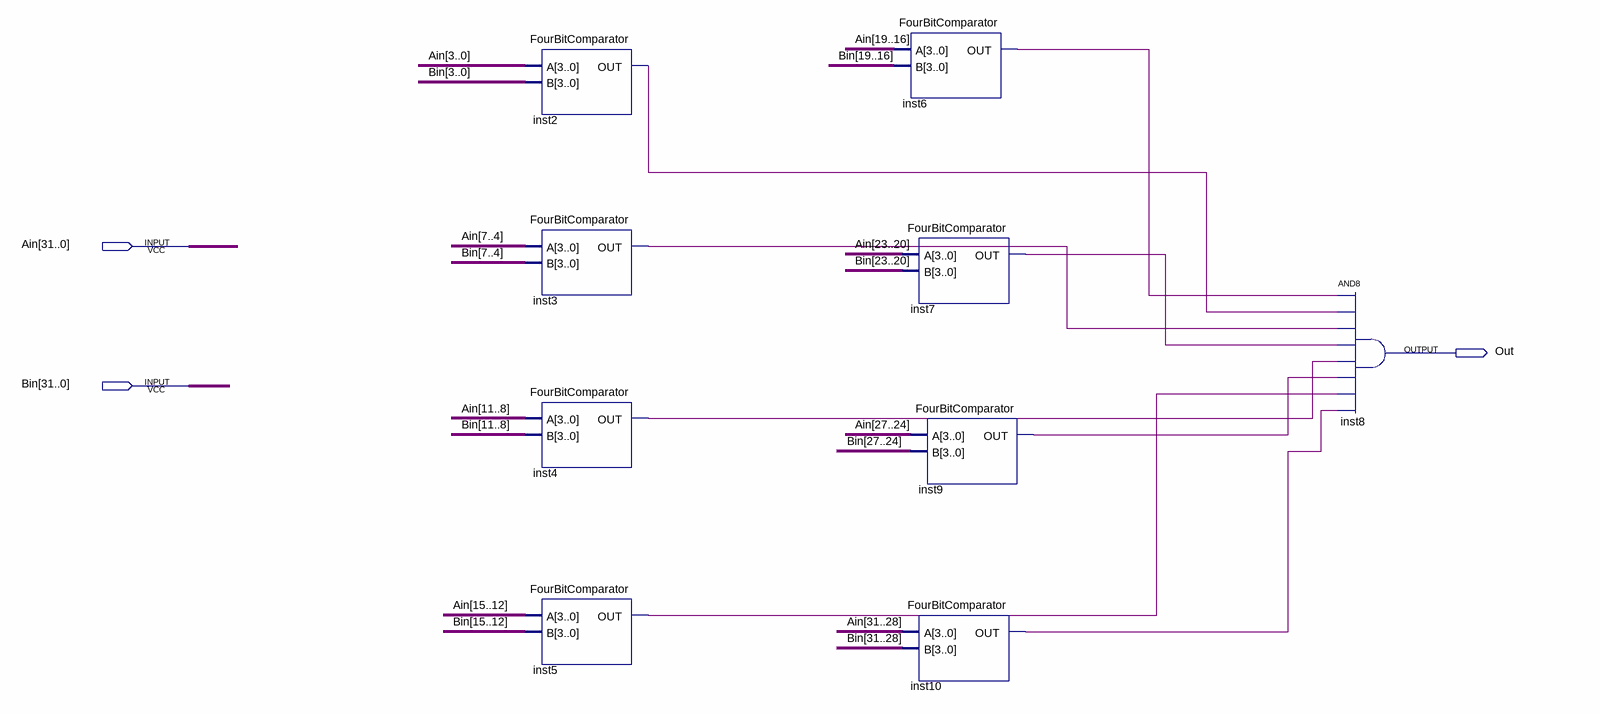
[diagram p0: schematic sheet]
// Quartus schematic ThirtyTwoBitComparator.bdf as structural Verilog: 9 symbols, 3 pins
module ThirtyTwoBitComparator (
  input  [31:0] Ain,
  input  [31:0] Bin,
  output Out
);

  wire inst2_out, inst3_out, inst4_out, inst5_out, inst6_out, inst7_out, inst9_out, inst10_out;

  FourBitComparator inst2 (.A(Ain[3:0]), .B(Bin[3:0]), .OUT(inst2_out));
  FourBitComparator inst3 (.A(Ain[7:4]), .B(Bin[7:4]), .OUT(inst3_out));
  FourBitComparator inst4 (.A(Ain[11:8]), .B(Bin[11:8]), .OUT(inst4_out));
  FourBitComparator inst5 (.A(Ain[15:12]), .B(Bin[15:12]), .OUT(inst5_out));
  FourBitComparator inst6 (.A(Ain[19:16]), .B(Bin[19:16]), .OUT(inst6_out));
  FourBitComparator inst7 (.A(Ain[23:20]), .B(Bin[23:20]), .OUT(inst7_out));
  FourBitComparator inst9 (.A(Ain[27:24]), .B(Bin[27:24]), .OUT(inst9_out));
  FourBitComparator inst10 (.A(Ain[31:28]), .B(Bin[31:28]), .OUT(inst10_out));
  and inst8 (Out, inst6_out, inst2_out, inst3_out, inst7_out, inst4_out, inst9_out, inst5_out, inst10_out);
endmodule
